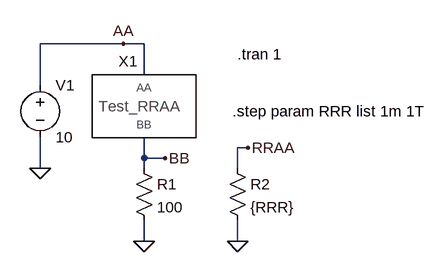
[diagram p0: schematic R3R_AA_TEST.asc]
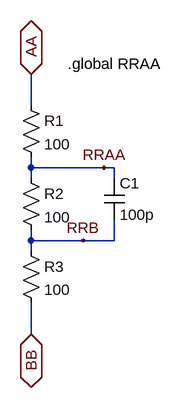
[diagram p1: sub-circuit r3r__aa.asc]
R3R_AA_TEST.asc, the LTspice schematic file:
Version 4
SHEET 1 880 680
WIRE 224 64 96 64
WIRE 256 64 224 64
WIRE 256 112 256 64
WIRE 96 128 96 64
WIRE 416 224 400 224
WIRE 256 240 256 208
WIRE 288 240 256 240
WIRE 96 256 96 208
WIRE 256 256 256 240
WIRE 400 256 400 224
WIRE 256 368 256 336
WIRE 400 368 400 336
FLAG 96 256 0
FLAG 400 368 0
FLAG 224 64 AA
FLAG 288 240 BB
FLAG 416 224 RRAA
FLAG 256 368 0
SYMBOL res 240 240 R0
SYMATTR InstName R1
SYMATTR Value 100
SYMBOL voltage 96 112 R0
WINDOW 123 0 0 Left 0
WINDOW 39 0 0 Left 0
SYMATTR InstName V1
SYMATTR Value 10
SYMBOL res 384 240 R0
SYMATTR InstName R2
SYMATTR Value {RRR}
SYMBOL R3R__AA 256 144 R0
SYMATTR InstName X1
TEXT 400 80 Left 2 !.tran 1
TEXT 392 168 Left 2 !.step param RRR list 1m 1T

r3r__aa.asc, the sub-circuit schematic file:
Version 4
SHEET 1 880 680
WIRE 80 144 80 96
WIRE 80 240 80 224
WIRE 192 240 80 240
WIRE 208 240 192 240
WIRE 80 256 80 240
WIRE 208 256 208 240
WIRE 80 352 80 336
WIRE 160 352 80 352
WIRE 208 352 208 320
WIRE 208 352 160 352
WIRE 80 368 80 352
WIRE 80 496 80 448
FLAG 192 240 RRAA
FLAG 160 352 RRB
FLAG 80 96 AA
IOPIN 80 96 BiDir
FLAG 80 496 BB
IOPIN 80 496 BiDir
SYMBOL res 64 128 R0
SYMATTR InstName R1
SYMATTR Value 100
SYMBOL res 64 240 R0
SYMATTR InstName R2
SYMATTR Value 100
SYMBOL res 64 352 R0
SYMATTR InstName R3
SYMATTR Value 100
SYMBOL cap 192 256 R0
SYMATTR InstName C1
SYMATTR Value 100p
TEXT 136 80 Left 2 !.global RRAA

The netlist it stands for:
* R3R_AA_TEST.asc
R1 BB 0 100
V1 AA 0 10
R2 RRAA 0 {RRR}
XX1 AA BB r3r__aa

* block symbol definitions
.subckt r3r__aa AA BB
R1 AA RRAA 100
R2 RRAA RRB 100
R3 RRB BB 100
C1 RRAA RRB 100p
.global RRAA
.ends r3r__aa

.tran 1
.step param RRR list 1m 1T
.backanno
.end